# Altium schematic sheet BMU_V50_BlockDiagram.SchDoc
size C
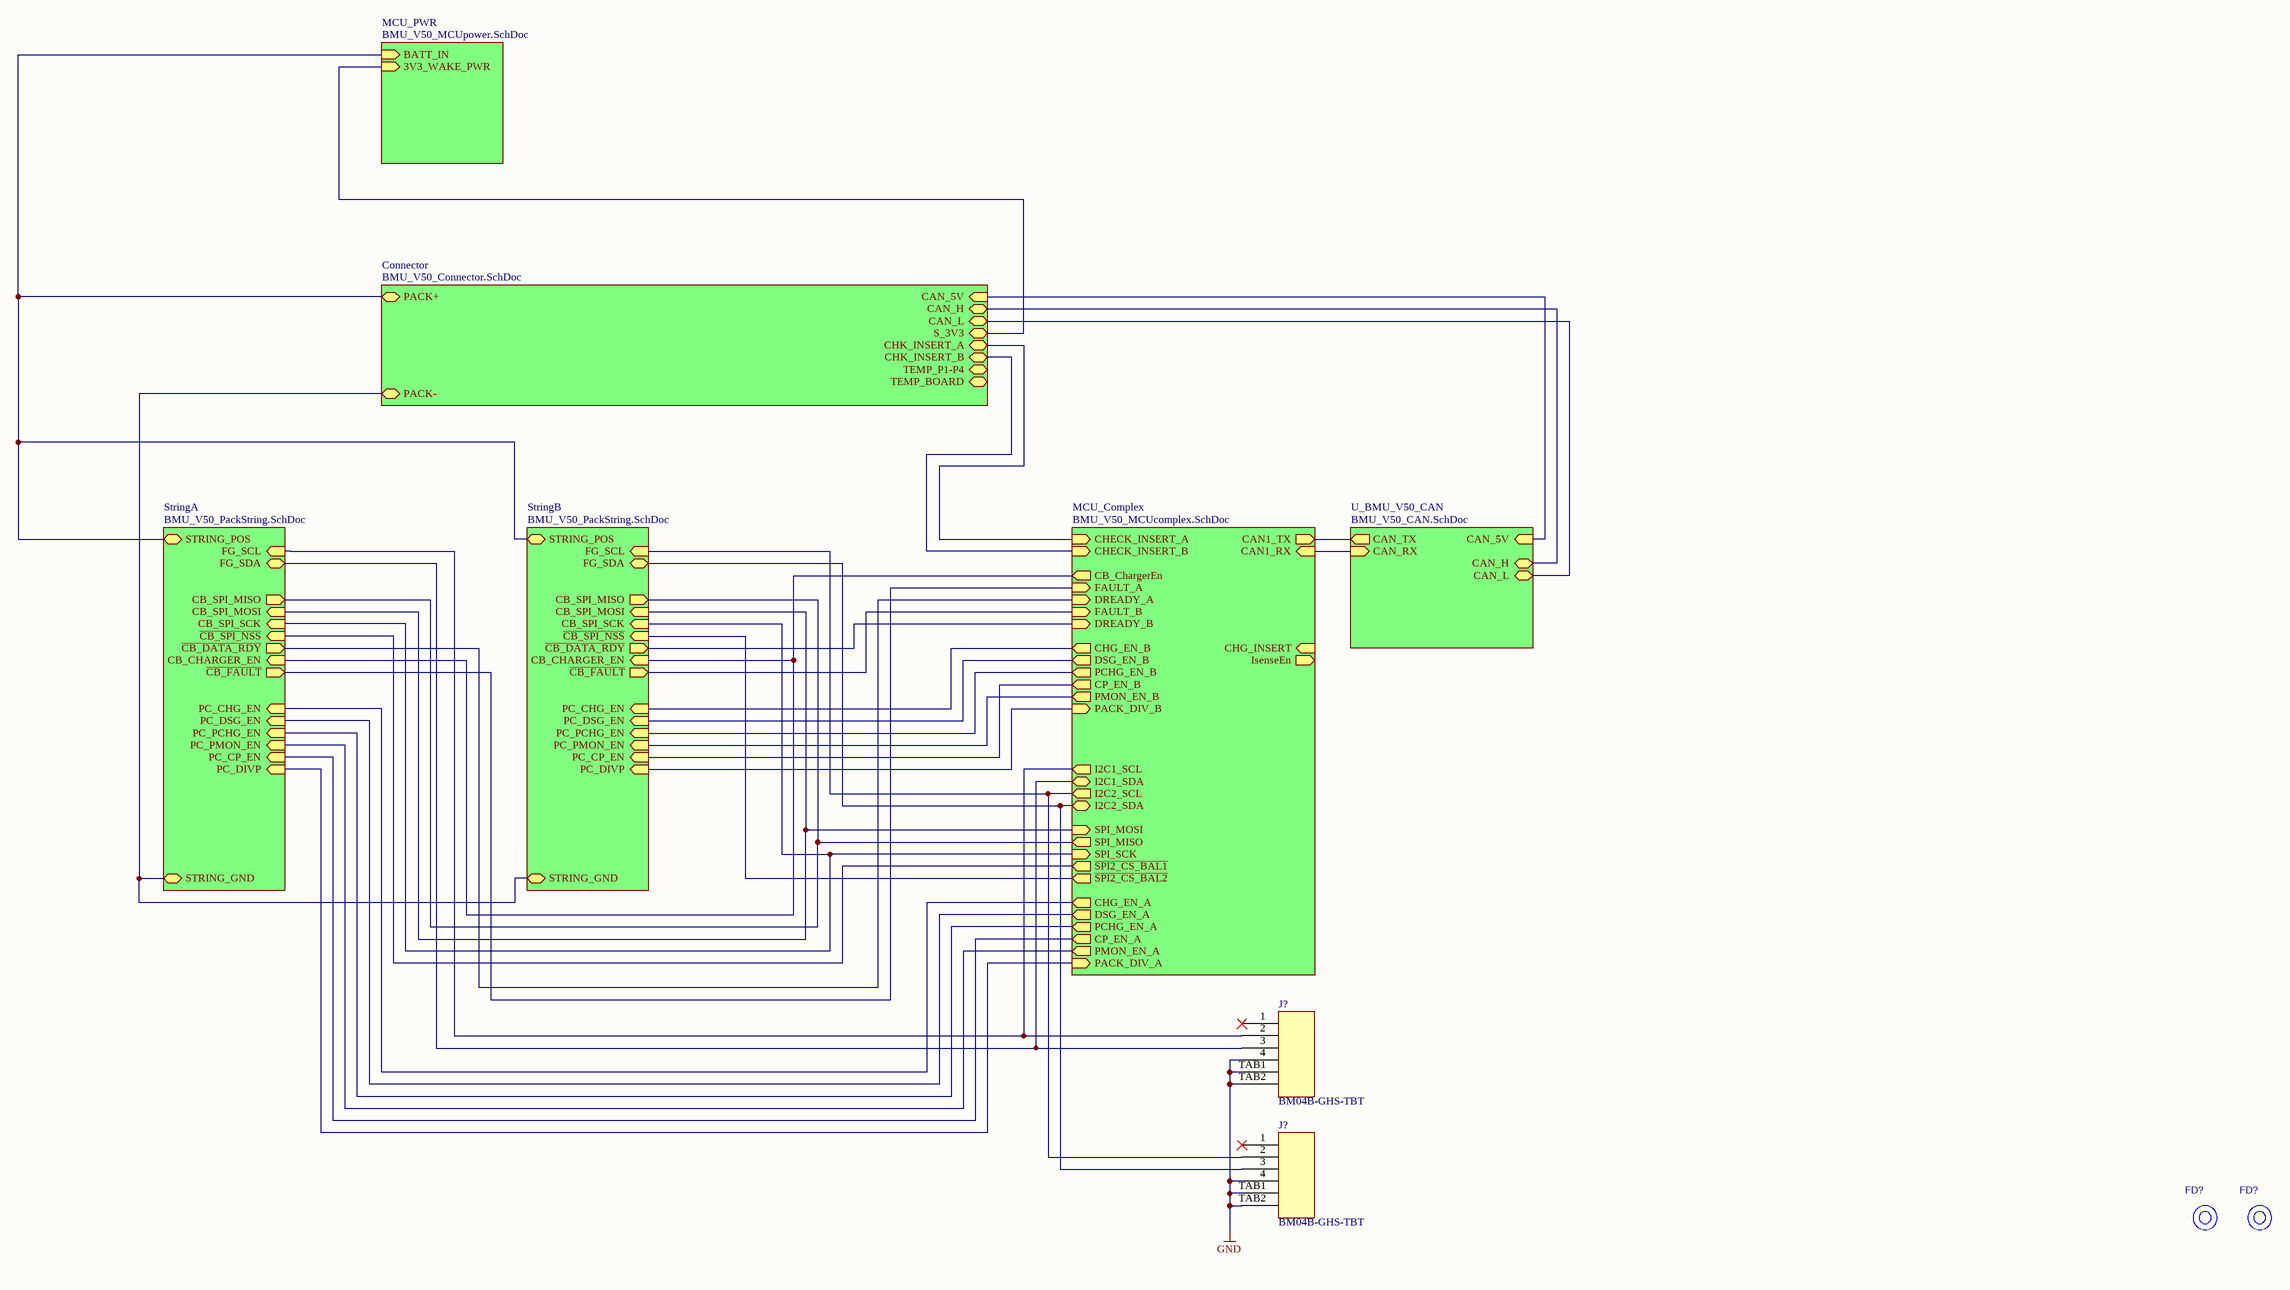
[diagram p0: BMU_V50_BlockDiagram.SchDoc]

## Parts
(Parts that share a designator on the sheet are numbered #1, #2 ... from top to bottom, then left to right.)
FD?#1  FIDUCIAL_REF  [FIDUCIAL_REFDES]  (value not drawn)  (no BOM)
FD?#2  FIDUCIAL_REF  [FIDUCIAL_REFDES]  (value not drawn)  (no BOM)
J?#1  BM04B-GHS-TBT  [BM04B-GHS-TBT]
J?#2  BM04B-GHS-TBT  [BM04B-GHS-TBT]

## Sub-sheets
Connector = BMU_V50_Connector.SchDoc: TEMP_P1-P4 (bidir), S_3V3 (bidir), CHK_INSERT_B (bidir), TEMP_BOARD (bidir), CHK_INSERT_A (bidir), PACK+ (bidir), CAN_5V (in), PACK- (bidir), CAN_H (bidir), CAN_L (bidir)
MCU_Complex = BMU_V50_MCUcomplex.SchDoc: CHG_INSERT (in), CHG_EN_A (out), ~{SPI2_CS_BAL1} (out), ~{SPI2_CS_BAL2} (out), I2C2_SCL (out), CAN1_RX (in), CAN1_TX (out), CB_ChargerEn (out), FAULT_A (in), I2C1_SDA (bidir), DREADY_A (in), SPI_SCK (in), IsenseEn (out), I2C1_SCL (out), SPI_MOSI (in), SPI_MISO (out), CHECK_INSERT_A (in), I2C2_SDA (bidir), CHECK_INSERT_B (in), FAULT_B (in), DREADY_B (in), DSG_EN_A (out), DSG_EN_B (out), CHG_EN_B (out), PACK_DIV_A (in), PACK_DIV_B (in), PMON_EN_A (out), PMON_EN_B (out), PCHG_EN_A (out), PCHG_EN_B (out), CP_EN_A (out), CP_EN_B (out)
MCU_PWR = BMU_V50_MCUpower.SchDoc: BATT_IN (in), 3V3_WAKE_PWR (in)
StringA = BMU_V50_PackString.SchDoc: FG_SDA (bidir), ~{CB_SPI_NSS} (in), ~{CB_DATA_RDY} (out), CB_CHARGER_EN (in), PC_CHG_EN (in), PC_CP_EN (in), STRING_GND (bidir), STRING_POS (bidir), FG_SCL (in), CB_SPI_MISO (out), CB_SPI_SCK (in), PC_PMON_EN (in), PC_PCHG_EN (in), PC_DSG_EN (in), CB_SPI_MOSI (in), PC_DIVP (in), ~{CB_FAULT} (out)
StringB = BMU_V50_PackString.SchDoc: FG_SDA (bidir), ~{CB_SPI_NSS} (in), ~{CB_DATA_RDY} (out), CB_CHARGER_EN (in), PC_CHG_EN (in), PC_CP_EN (in), STRING_GND (bidir), STRING_POS (bidir), FG_SCL (in), CB_SPI_MISO (out), CB_SPI_SCK (in), PC_PMON_EN (in), PC_PCHG_EN (in), PC_DSG_EN (in), CB_SPI_MOSI (in), PC_DIVP (in), ~{CB_FAULT} (out)
U_BMU_V50_CAN = BMU_V50_CAN.SchDoc: CAN_TX (out), CAN_RX (in), CAN_5V (in), CAN_H (bidir), CAN_L (bidir)

## Nets
GND: J?#1.4 J?#1.TAB1 J?#1.TAB2 J?#2.4 J?#2.TAB1 J?#2.TAB2
NetJ?#1_2: J?#1.2 ; sheet StringA/FG_SCL, sheet MCU_Complex/I2C1_SCL
NetJ?#1_3: J?#1.3 ; sheet StringA/FG_SDA, sheet MCU_Complex/I2C1_SDA
NetJ?#2_2: J?#2.2 ; sheet MCU_Complex/I2C2_SCL, sheet StringB/FG_SCL
NetJ?#2_3: J?#2.3 ; sheet MCU_Complex/I2C2_SDA, sheet StringB/FG_SDA
(unnamed): sheet Connector/S_3V3, sheet MCU_PWR/3V3_WAKE_PWR
(unnamed): sheet Connector/CHK_INSERT_B, sheet MCU_Complex/CHECK_INSERT_B
(unnamed): sheet Connector/CHK_INSERT_A, sheet MCU_Complex/CHECK_INSERT_A
(unnamed): sheet Connector/PACK+, sheet StringA/STRING_POS, sheet MCU_PWR/BATT_IN, sheet StringB/STRING_POS
(unnamed): sheet Connector/CAN_5V, sheet U_BMU_V50_CAN/CAN_5V
(unnamed): sheet Connector/PACK-, sheet StringA/STRING_GND, sheet StringB/STRING_GND
(unnamed): sheet Connector/CAN_H, sheet U_BMU_V50_CAN/CAN_H
(unnamed): sheet Connector/CAN_L, sheet U_BMU_V50_CAN/CAN_L
(unnamed): sheet StringA/~{CB_SPI_NSS}, sheet MCU_Complex/~{SPI2_CS_BAL1}
(unnamed): sheet StringA/~{CB_DATA_RDY}, sheet MCU_Complex/DREADY_A
(unnamed): sheet StringA/CB_CHARGER_EN, sheet MCU_Complex/CB_ChargerEn, sheet StringB/CB_CHARGER_EN
(unnamed): sheet StringA/PC_CHG_EN, sheet MCU_Complex/CHG_EN_A
(unnamed): sheet StringA/PC_CP_EN, sheet MCU_Complex/CP_EN_A
(unnamed): sheet StringA/CB_SPI_MISO, sheet MCU_Complex/SPI_MISO, sheet StringB/CB_SPI_MISO
(unnamed): sheet StringA/CB_SPI_SCK, sheet MCU_Complex/SPI_SCK, sheet StringB/CB_SPI_SCK
(unnamed): sheet StringA/PC_PMON_EN, sheet MCU_Complex/PMON_EN_A
(unnamed): sheet StringA/PC_PCHG_EN, sheet MCU_Complex/PCHG_EN_A
(unnamed): sheet StringA/PC_DSG_EN, sheet MCU_Complex/DSG_EN_A
(unnamed): sheet StringA/CB_SPI_MOSI, sheet MCU_Complex/SPI_MOSI, sheet StringB/CB_SPI_MOSI
(unnamed): sheet StringA/PC_DIVP, sheet MCU_Complex/PACK_DIV_A
(unnamed): sheet StringA/~{CB_FAULT}, sheet MCU_Complex/FAULT_A
(unnamed): sheet MCU_Complex/~{SPI2_CS_BAL2}, sheet StringB/~{CB_SPI_NSS}
(unnamed): sheet MCU_Complex/CAN1_RX, sheet U_BMU_V50_CAN/CAN_RX
(unnamed): sheet MCU_Complex/CAN1_TX, sheet U_BMU_V50_CAN/CAN_TX
(unnamed): sheet MCU_Complex/FAULT_B, sheet StringB/~{CB_FAULT}
(unnamed): sheet MCU_Complex/DREADY_B, sheet StringB/~{CB_DATA_RDY}
(unnamed): sheet MCU_Complex/DSG_EN_B, sheet StringB/PC_DSG_EN
(unnamed): sheet MCU_Complex/CHG_EN_B, sheet StringB/PC_CHG_EN
(unnamed): sheet MCU_Complex/PACK_DIV_B, sheet StringB/PC_DIVP
(unnamed): sheet MCU_Complex/PMON_EN_B, sheet StringB/PC_PMON_EN
(unnamed): sheet MCU_Complex/PCHG_EN_B, sheet StringB/PC_PCHG_EN
(unnamed): sheet MCU_Complex/CP_EN_B, sheet StringB/PC_CP_EN

Not connected (* = marked no-connect by the designer): FD?#1 1; FD?#2 1; J?#1 1*; J?#2 1*

## Notes on the sheet
- Title
- MATTERNET
- PROPRIETRY & CONFIDENTIAL
  THE INFORMATION CONTAINS IN THIS DRAWING
  IS THE SOLE PROPERTY OF  MATTERNET Inc.
  ANY REPRODUCTION IN PART OR AS WHOLE
  WITHOUT A WRITTEN PERMISSION OF
  MATTERNET Inc. IS PROHIBITED
- Size:
- Date:
- File:
- C
- Number:
- Time:
- Revision:
- Sheet
- of
- 161 E. Evelyn Ave.
- Mountain View,
- CA 94041 USA

## Library data of the parts
FD?#1 FD?#2 = FIDUCIAL_REF: Option: AB
J?#1 J?#2 = BM04B-GHS-TBT: CONN HEADER GH TOP 4POS 1.25MM; System: Connector; ComponentLink1Description: JST GH Series Datasheet; ComponentLink1URL: http://www.jst-mfg.com/product/pdf/eng/eGH.pdf; Supplier 2: Digi-Key; Supplier Part Number 2: 455-1580-1-ND; Supplier 1: Heilind Electronics; Supplier Part Number 1: JSTBM04B-GHS-TBT(LF)(SN)N